# Altium schematic sheet PowerAmplifier_BFU590G.SchDoc: Power Amplifier
size A4; Author: Almela; Revision: 1.2; SheetNumber: 4; SheetTotal: 7
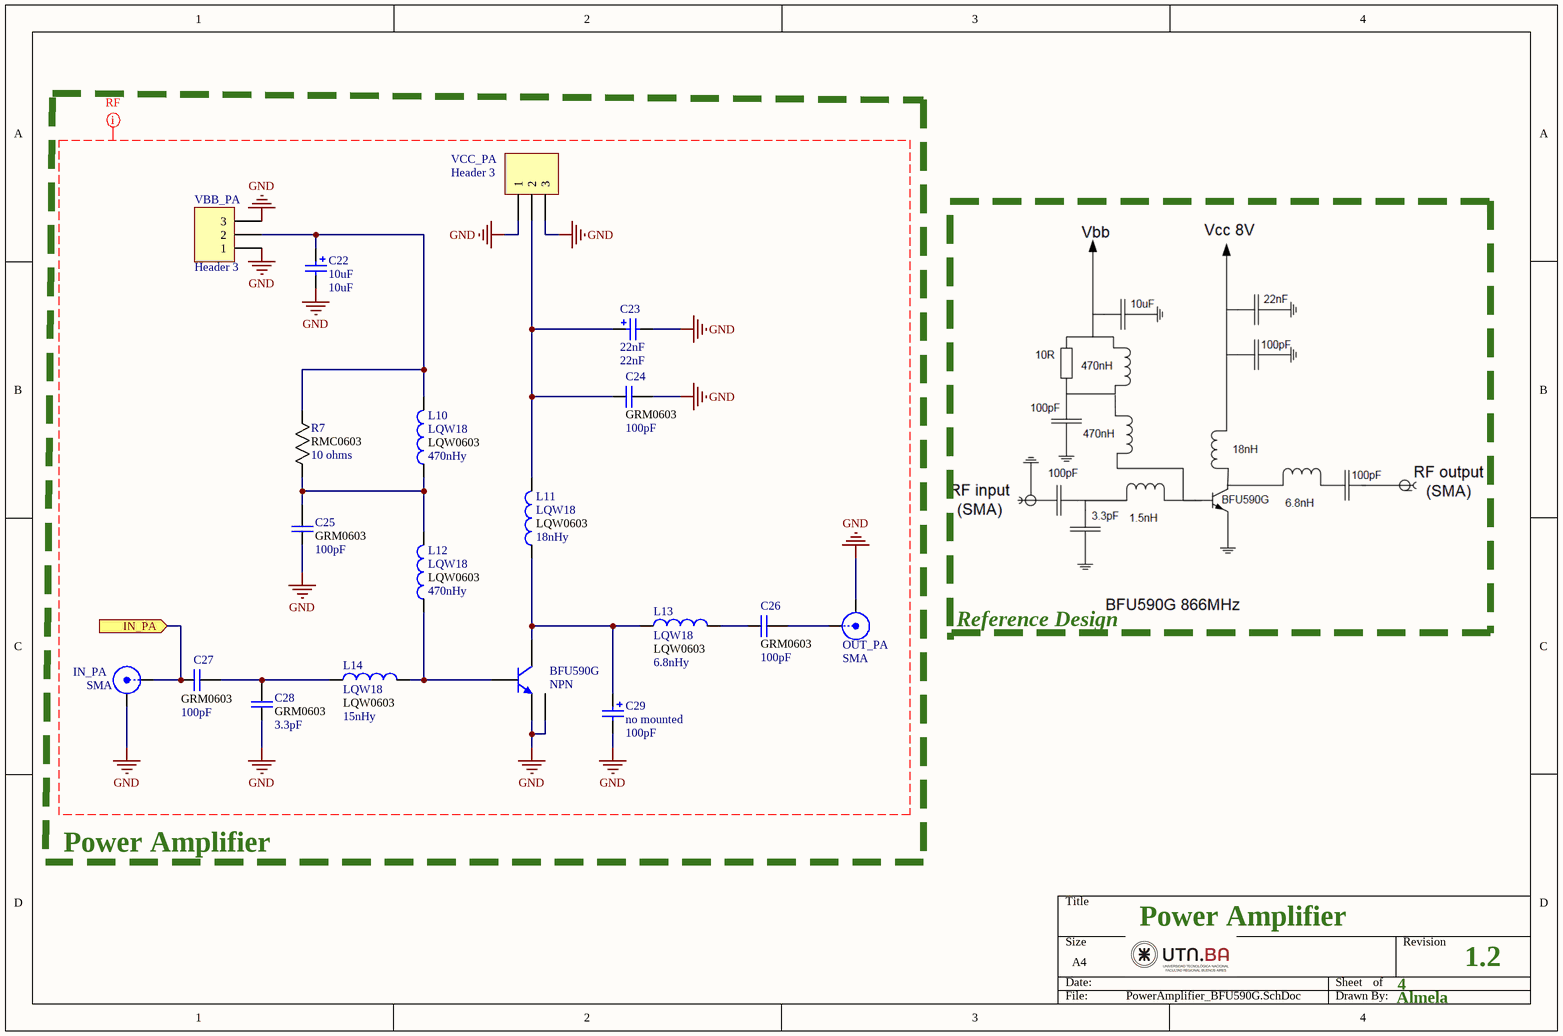
[diagram p0: PowerAmplifier_BFU590G.SchDoc]

## Parts
BFU590G  NPN  [SOT223_L]
C22  10uF  [6-0805_N]
C23  22nF  [6-0805_N]
C24  value 100pF  footprint: GRM0603  [CAPC1608X90N]  (hidden comment: Cap 0603)
C25  value 100pF  footprint: GRM0603  [CAPC1608X90N]  (hidden comment: Cap 0603)
C26  value 100pF  footprint: GRM0603  [CAPC1608X90N]  (hidden comment: Cap 0603)
C27  value 100pF  footprint: GRM0603  [CAPC1608X90N]  (hidden comment: Cap 0603)
C28  value 3.3pF  footprint: GRM0603  [CAPC1608X90N]  (hidden comment: Cap 0603)
C29  no mounted  value 100pF  [6-0805_N]
IN_PA  SMA  [SMA-142-0701-851]
L10  LQW18  value 470nHy  Parameter 1: LQW0603  [INDC1608X100N]
L11  LQW18  value 18nHy  Parameter 1: LQW0603  [INDC1608X100N]
L12  LQW18  value 470nHy  Parameter 1: LQW0603  [INDC1608X100N]
L13  LQW18  value 6.8nHy  Parameter 1: LQW0603  [INDC1608X100N]
L14  LQW18  value 15nHy  Parameter 1: LQW0603  [INDC1608X100N]
OUT_PA  SMA  [SMA-142-0701-851]
R7  value 10 ohms  footprint: RMC0603  [RESC1508X55N]  (hidden comment: Resistor)
VBB_PA  Header 3  [HDR1X3]
VCC_PA  Header 3  [HDR1X3]

## Ports
IN_PA (in)

## Nets
GND: BFU590G.1(E) BFU590G.3(E) C22.2 C23.2 C24.2 C25.1 C28.1 C29.2 IN_PA.2(Y) OUT_PA.2(Y) VBB_PA.1 VBB_PA.3 VCC_PA.1 VCC_PA.3
IN_PA: C27.1 IN_PA.1(X) ; port IN_PA
NetBFU590G_2: BFU590G.2(B) L12.1 L14.2
NetBFU590G_4: BFU590G.4(C) C29.1 L11.1 L13.1
NetC22_1: C22.1 L10.2 R7.2 VBB_PA.2
NetC23_1: C23.1 C24.1 L11.2 VCC_PA.2
NetC25_2: C25.2 L10.1 L12.2 R7.1
NetC26_1: C26.1 L13.2
NetC26_2: C26.2 OUT_PA.1(X)
NetC27_2: C27.2 C28.2 L14.1

## Layout directives
net class RF50R: GND

## Notes on the sheet
- Reference Design
- Power Amplifier

## Library data of the parts
BFU590G = BFU590G: NPN Bipolar Transistor; Published: 8-Jun-2000; LatestRevisionDate: 17-Jul-2002; LatestRevisionNote: Re-released for DXP Platform.; PackageReference: TO-226-AA; Publisher: Altium Limited; PackageDescription: TO, Flat Index; 3 In-Line, Axial Leads; Body Dia. 4.8mm; Leads 0.55 x 0.51 mm (max); Code_JEDEC: TO-226-AA
C22 = Cap Pol2_7: Polarized Capacitor (Axial); Published: 8-Jun-2000; LatestRevisionDate: 17-Jul-2002; LatestRevisionNote: Re-released for DXP Platform.; PackageReference: POLAR0.8; Publisher: Altium Limited; PackageDescription: Polarized Capacitor; 2 Leads; Value: 10uF
C23 C29 = Cap Pol2_1: Polarized Capacitor (Axial); Published: 8-Jun-2000; LatestRevisionDate: 17-Jul-2002; LatestRevisionNote: Re-released for DXP Platform.; PackageReference: POLAR0.8; Publisher: Altium Limited; PackageDescription: Polarized Capacitor; 2 Leads
  C23: Value: 22nF
C24-C28 = Cap: Capacitor GRM18 0603; Published: 8-Jun-2000; LatestRevisionDate: 17-Jul-2002; LatestRevisionNote: Re-released for DXP Platform.; PackageReference: POLAR0.8; Publisher: Altium Limited; PackageDescription: Polarized Capacitor; 2 Leads; Supplier 1: Mouser
IN_PA OUT_PA = SMA: SMA Straight Connector; LatestRevisionDate: 17-Jul-2002; LatestRevisionNote: Re-released for DXP Platform.; Publisher: Altium Limited
L10-L14 = LQW18: Ind RF Chip Wirewound 18nH 5% 100MHz 40Q-Factor 550mA 0603 Paper T/R; MP: LQW18AN18NJ00D; Package: None; Price: None; Availability: Unavailable
R7 = Resistor: Resistor RMC0603; Mfr_Name: Stackpole International
VBB_PA VCC_PA = Header 3: Header, 3-Pin; LatestRevisionDate: 17-Jul-2002; LatestRevisionNote: Re-released for DXP Platform.; Publisher: Altium Limited